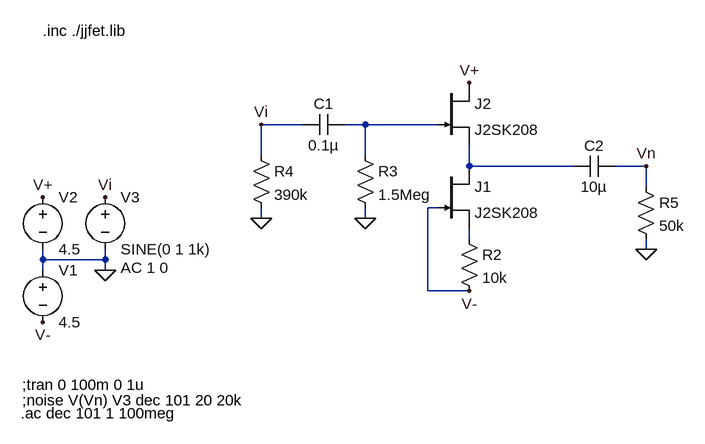
[diagram p0: schematic JFET_CCS.asc]
JFET_CCS.asc, the LTspice schematic file:
Version 4
SHEET 1 880 680
WIRE -64 -48 -128 -48
WIRE 32 -48 0 -48
WIRE 144 -48 32 -48
WIRE -128 0 -128 -48
WIRE 32 0 32 -48
WIRE 192 16 192 -16
WIRE 352 16 192 16
WIRE 464 16 416 16
WIRE 464 48 464 16
WIRE 144 80 128 80
WIRE -128 96 -128 80
WIRE 32 96 32 80
WIRE 192 128 192 112
WIRE 464 144 464 128
WIRE -464 160 -464 144
WIRE -368 160 -368 144
WIRE -368 160 -464 160
WIRE -464 176 -464 160
WIRE -368 176 -368 160
WIRE 128 208 128 80
WIRE 192 208 128 208
FLAG -368 176 0
FLAG -464 64 V+
FLAG -464 256 V-
FLAG -368 64 Vi
FLAG 32 96 0
FLAG -128 96 0
FLAG 192 208 V-
FLAG 192 -112 V+
FLAG -128 -48 Vi
FLAG 464 144 0
FLAG 464 16 Vn
SYMBOL njf 144 16 R0
SYMATTR InstName J1
SYMATTR Value J2SK208
SYMBOL njf 144 -112 R0
SYMATTR InstName J2
SYMATTR Value J2SK208
SYMBOL res 176 112 R0
SYMATTR InstName R2
SYMATTR Value 10k
SYMBOL voltage -464 160 R0
SYMATTR InstName V1
SYMATTR Value 4.5
SYMBOL voltage -464 48 R0
SYMATTR InstName V2
SYMATTR Value 4.5
SYMBOL voltage -368 48 R0
WINDOW 123 24 124 Left 2
WINDOW 39 0 0 Left 2
SYMATTR Value2 AC 1 0
SYMATTR InstName V3
SYMATTR Value SINE(0 1 1k)
SYMBOL res 16 -16 R0
SYMATTR InstName R3
SYMATTR Value 1.5Meg
SYMBOL cap 0 -64 R90
WINDOW 0 0 32 VBottom 2
WINDOW 3 32 32 VTop 2
SYMATTR InstName C1
SYMATTR Value 0.1µ
SYMBOL res -144 -16 R0
SYMATTR InstName R4
SYMATTR Value 390k
SYMBOL cap 416 0 R90
WINDOW 0 0 32 VBottom 2
WINDOW 3 32 32 VTop 2
SYMATTR InstName C2
SYMATTR Value 10µ
SYMBOL res 448 32 R0
SYMATTR InstName R5
SYMATTR Value 50k
TEXT -464 -192 Left 2 !.inc ./jjfet.lib
TEXT -496 352 Left 2 !;tran 0 100m 0 1u
TEXT -496 376 Left 2 !;noise V(Vn) V3 dec 101 20 20k
TEXT -498 396 Left 2 !.ac dec 101 1 100meg

The netlist it stands for:
* JFET_CCS.asc
J1 N002 V- N003 J2SK208
J2 V+ N001 N002 J2SK208
R2 N003 V- 10k
V1 0 V- 4.5
V2 V+ 0 4.5
V3 Vi 0 SINE(0 1 1k) AC 1 0
R3 N001 0 1.5Meg
C1 N001 Vi 0.1µ
R4 Vi 0 390k
C2 Vn N002 10µ
R5 Vn 0 50k
.model NJF NJF
.model PJF PJF
.lib standard.jft
.inc ./jjfet.lib
;tran 0 100m 0 1u
;noise V(Vn) V3 dec 101 20 20k
.ac dec 101 1 100meg
.backanno
.end